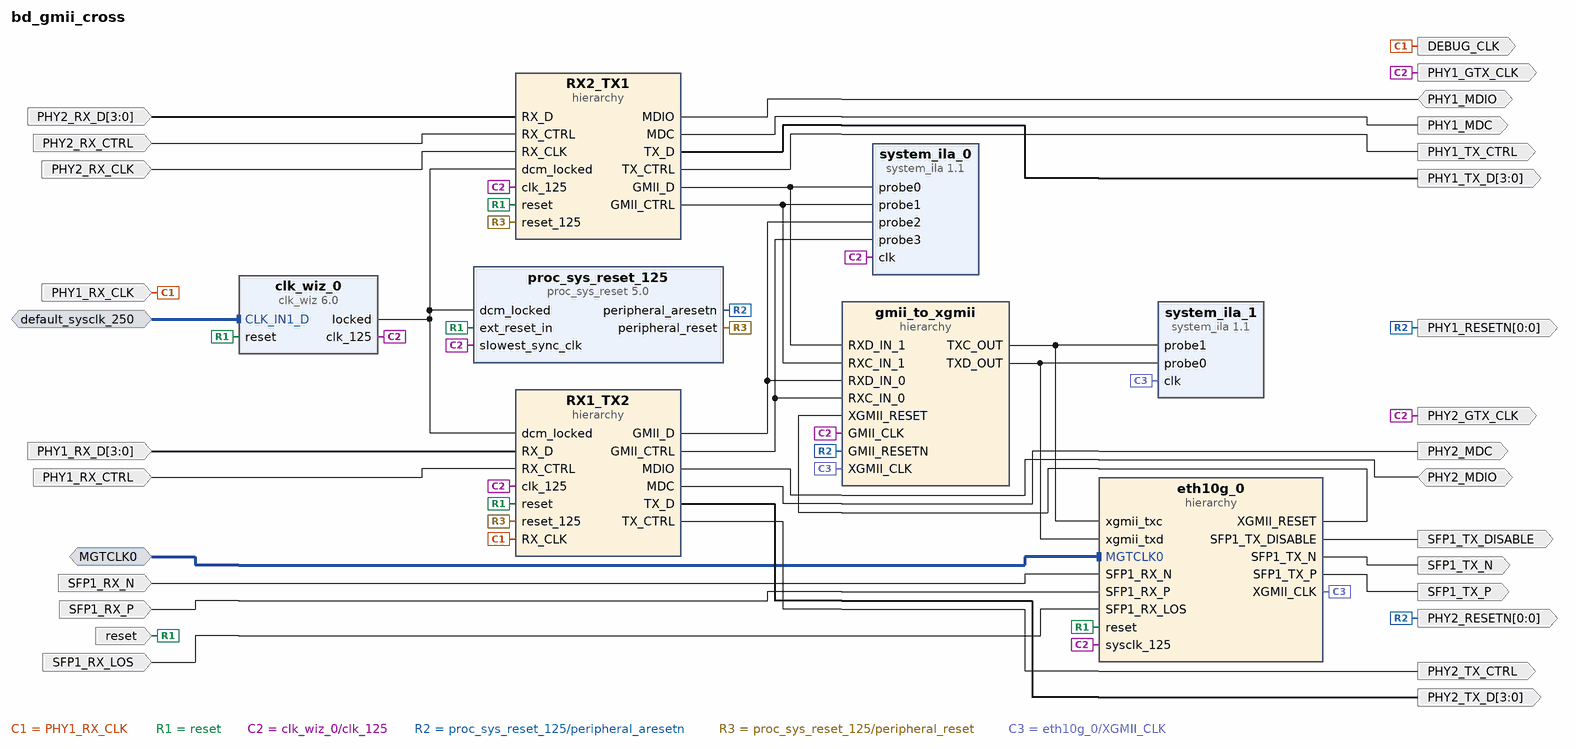
[diagram p0: block diagram of the top level]
# Vivado block design bd_gmii_cross, xcku040-fbva676-1-c, Vivado 2018.2
create_bd_design bd_gmii_cross

create_bd_intf_port -mode Slave -vlnv xilinx.com:interface:diff_clock_rtl:1.0 default_sysclk_250
set_property -dict {CONFIG.FREQ_HZ 250000000} [get_bd_intf_ports default_sysclk_250]
create_bd_intf_port -mode Slave -vlnv xilinx.com:interface:diff_clock_rtl:1.0 MGTCLK0
set_property -dict {CONFIG.FREQ_HZ 156250000} [get_bd_intf_ports MGTCLK0]
create_bd_port -dir I -type clk PHY1_RX_CLK
set_property -dict {CONFIG.FREQ_HZ 125000000} [get_bd_ports PHY1_RX_CLK]
create_bd_port -dir O -type clk DEBUG_CLK
create_bd_port -dir I -type rst reset
set_property -dict {CONFIG.POLARITY ACTIVE_HIGH} [get_bd_ports reset]
create_bd_port -dir IO PHY1_MDIO
create_bd_port -dir O -from 3 -to 0 PHY1_TX_D
create_bd_port -dir O PHY1_MDC
create_bd_port -dir O PHY1_TX_CTRL
create_bd_port -dir O -type clk PHY2_GTX_CLK
create_bd_port -dir O -type clk PHY1_GTX_CLK
create_bd_port -dir I -from 3 -to 0 PHY2_RX_D
create_bd_port -dir I PHY2_RX_CTRL
create_bd_port -dir I -type clk PHY2_RX_CLK
set_property -dict {CONFIG.FREQ_HZ 125000000} [get_bd_ports PHY2_RX_CLK]
create_bd_port -dir I -from 3 -to 0 PHY1_RX_D
create_bd_port -dir I PHY1_RX_CTRL
create_bd_port -dir IO PHY2_MDIO
create_bd_port -dir O -type clk PHY2_MDC
create_bd_port -dir O -from 3 -to 0 PHY2_TX_D
create_bd_port -dir O PHY2_TX_CTRL
create_bd_port -dir I SFP1_RX_N
create_bd_port -dir I SFP1_RX_P
create_bd_port -dir O SFP1_TX_N
create_bd_port -dir O SFP1_TX_P
create_bd_port -dir O SFP1_TX_DISABLE
create_bd_port -dir I SFP1_RX_LOS
create_bd_port -dir O -from 0 -to 0 -type rst PHY1_RESETN
create_bd_port -dir O -from 0 -to 0 PHY2_RESETN

create_bd_cell -type hier RX2_TX1
create_bd_cell -type ip -vlnv xilinx.com:ip:clk_wiz:6.0 clk_wiz_0
set_property -dict [list \
  CONFIG.USE_PHASE_ALIGNMENT true \
  CONFIG.CLKIN1_JITTER_PS 40.0 \
  CONFIG.CLKOUT1_USED true \
  CONFIG.CLKOUT2_USED false \
  CONFIG.CLKOUT3_USED false \
  CONFIG.NUM_OUT_CLKS 1 \
  CONFIG.CLK_OUT1_PORT clk_125 \
  CONFIG.CLK_OUT2_PORT clk_out2 \
  CONFIG.CLK_OUT3_PORT clk_out3 \
  CONFIG.CLKOUT1_REQUESTED_OUT_FREQ 125.000 \
  CONFIG.CLKOUT2_REQUESTED_OUT_FREQ 100.000 \
  CONFIG.CLKOUT3_REQUESTED_OUT_FREQ 100.000 \
  CONFIG.PRIM_SOURCE Differential_clock_capable_pin \
  CONFIG.MMCM_DIVCLK_DIVIDE 1 \
  CONFIG.MMCM_CLKFBOUT_MULT_F 4.000 \
  CONFIG.MMCM_CLKIN1_PERIOD 4.000 \
  CONFIG.MMCM_CLKIN2_PERIOD 10.0 \
  CONFIG.MMCM_CLKOUT0_DIVIDE_F 8.000 \
  CONFIG.MMCM_CLKOUT1_DIVIDE 1 \
  CONFIG.MMCM_CLKOUT2_DIVIDE 1 \
  CONFIG.USE_BOARD_FLOW true \
  CONFIG.CLK_IN1_BOARD_INTERFACE default_sysclk_250 \
  CONFIG.RESET_BOARD_INTERFACE reset \
  CONFIG.CLKOUT1_JITTER 102.531 \
  CONFIG.CLKOUT1_PHASE_ERROR 85.928 \
  CONFIG.CLKOUT2_JITTER 107.111 \
  CONFIG.CLKOUT2_PHASE_ERROR 85.928 \
  CONFIG.CLKOUT3_JITTER 89.528 \
  CONFIG.CLKOUT3_PHASE_ERROR 85.928 \
] [get_bd_cells clk_wiz_0]
create_bd_cell -type hier RX1_TX2
create_bd_cell -type ip -vlnv xilinx.com:ip:system_ila:1.1 system_ila_0
set_property -dict {CONFIG.C_NUM_OF_PROBES 4 CONFIG.C_MON_TYPE NATIVE} [get_bd_cells system_ila_0]
create_bd_cell -type hier eth10g_0
create_bd_cell -type ip -vlnv xilinx.com:ip:proc_sys_reset:5.0 proc_sys_reset_125
create_bd_cell -type hier gmii_to_xgmii
create_bd_cell -type ip -vlnv xilinx.com:ip:system_ila:1.1 system_ila_1
set_property -dict {CONFIG.C_NUM_OF_PROBES 2 CONFIG.C_MON_TYPE NATIVE} [get_bd_cells system_ila_1]

# ---- hierarchy /RX2_TX1 ----
current_bd_instance /RX2_TX1
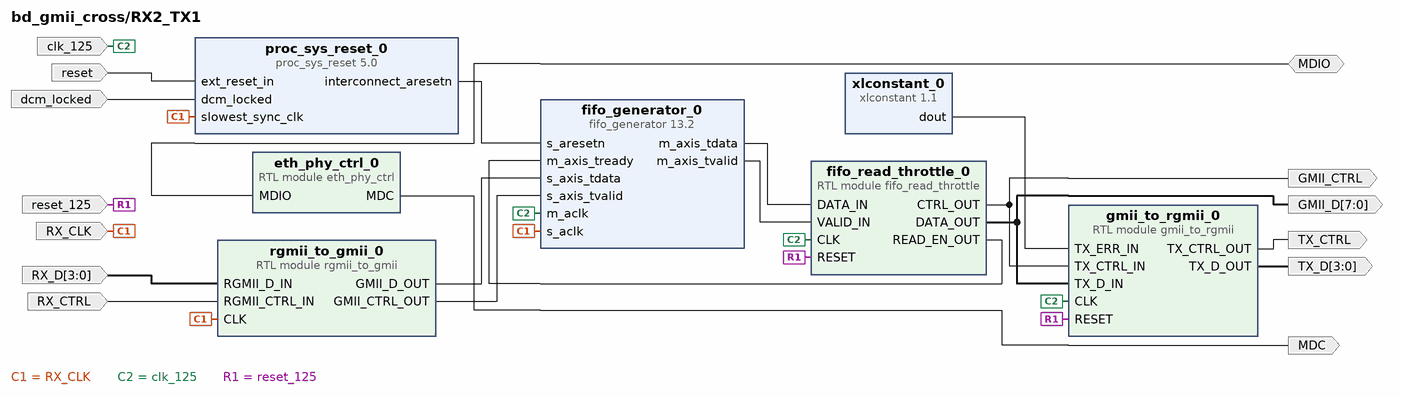
[diagram p1: block diagram inside /RX2_TX1]
create_bd_pin -dir IO MDIO
create_bd_pin -dir I -from 3 -to 0 RX_D
create_bd_pin -dir I RX_CTRL
create_bd_pin -dir O MDC
create_bd_pin -dir I -type clk RX_CLK
create_bd_pin -dir O -from 3 -to 0 TX_D
create_bd_pin -dir O TX_CTRL
create_bd_pin -dir I -type rst reset
create_bd_pin -dir I -type clk clk_125
create_bd_pin -dir I dcm_locked
create_bd_pin -dir O -from 7 -to 0 GMII_D
create_bd_pin -dir O GMII_CTRL
create_bd_pin -dir I -type rst reset_125

create_bd_cell -type module -reference fifo_read_throttle fifo_read_throttle_0
create_bd_cell -type ip -vlnv xilinx.com:ip:fifo_generator:13.2 fifo_generator_0
set_property -dict [list \
  CONFIG.Fifo_Implementation Independent_Clocks_Distributed_RAM \
  CONFIG.INTERFACE_TYPE AXI_STREAM \
  CONFIG.Performance_Options Standard_FIFO \
  CONFIG.Input_Data_Width 8 \
  CONFIG.Input_Depth 32 \
  CONFIG.Full_Flags_Reset_Value 1 \
  CONFIG.Valid_Flag true \
  CONFIG.Clock_Type_AXI Independent_Clock \
  CONFIG.TUSER_WIDTH 0 \
  CONFIG.FIFO_Implementation_wach Independent_Clocks_Distributed_RAM \
  CONFIG.FIFO_Implementation_wdch Independent_Clocks_Builtin_FIFO \
  CONFIG.FIFO_Implementation_wrch Independent_Clocks_Distributed_RAM \
  CONFIG.FIFO_Implementation_rach Independent_Clocks_Distributed_RAM \
  CONFIG.FIFO_Implementation_rdch Independent_Clocks_Builtin_FIFO \
  CONFIG.FIFO_Implementation_axis Independent_Clocks_Distributed_RAM \
  CONFIG.Input_Depth_axis 32 \
] [get_bd_cells fifo_generator_0]
create_bd_cell -type ip -vlnv xilinx.com:ip:xlconstant:1.1 xlconstant_0
set_property -dict {CONFIG.CONST_VAL 0} [get_bd_cells xlconstant_0]
create_bd_cell -type module -reference rgmii_to_gmii rgmii_to_gmii_0
create_bd_cell -type module -reference gmii_to_rgmii gmii_to_rgmii_0
create_bd_cell -type module -reference eth_phy_ctrl eth_phy_ctrl_0
create_bd_cell -type ip -vlnv xilinx.com:ip:proc_sys_reset:5.0 proc_sys_reset_0

# ---- hierarchy /RX1_TX2 ----
current_bd_instance /RX1_TX2
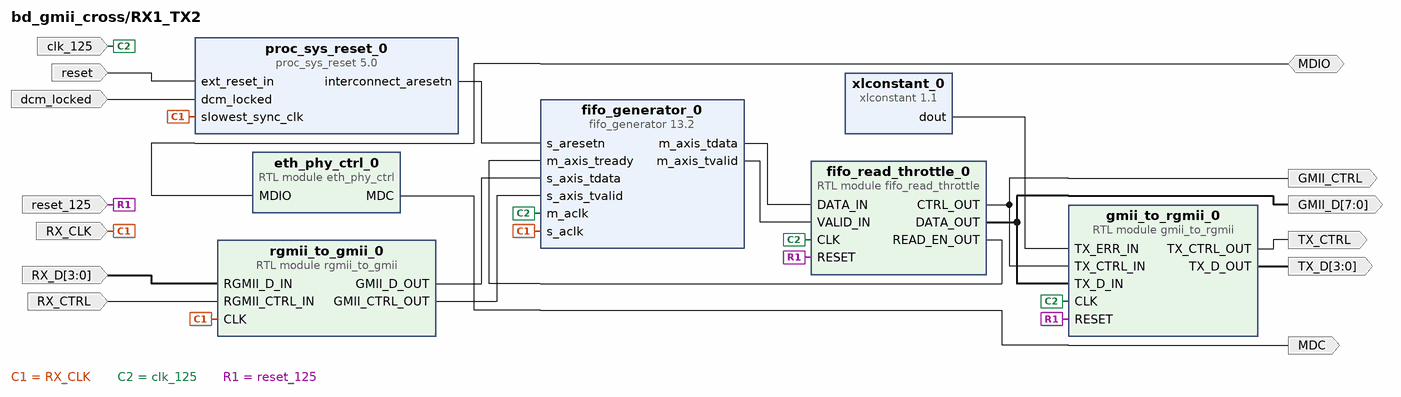
[diagram p2: block diagram inside /RX1_TX2]
create_bd_pin -dir IO MDIO
create_bd_pin -dir I -from 3 -to 0 RX_D
create_bd_pin -dir I RX_CTRL
create_bd_pin -dir O MDC
create_bd_pin -dir I -type clk RX_CLK
create_bd_pin -dir O -from 3 -to 0 TX_D
create_bd_pin -dir O TX_CTRL
create_bd_pin -dir I -type rst reset
create_bd_pin -dir I -type clk clk_125
create_bd_pin -dir I dcm_locked
create_bd_pin -dir O -from 7 -to 0 GMII_D
create_bd_pin -dir O GMII_CTRL
create_bd_pin -dir I -type rst reset_125

create_bd_cell -type module -reference fifo_read_throttle fifo_read_throttle_0
create_bd_cell -type ip -vlnv xilinx.com:ip:fifo_generator:13.2 fifo_generator_0
set_property -dict [list \
  CONFIG.Fifo_Implementation Independent_Clocks_Distributed_RAM \
  CONFIG.INTERFACE_TYPE AXI_STREAM \
  CONFIG.Performance_Options Standard_FIFO \
  CONFIG.Input_Data_Width 8 \
  CONFIG.Input_Depth 32 \
  CONFIG.Full_Flags_Reset_Value 1 \
  CONFIG.Valid_Flag true \
  CONFIG.Clock_Type_AXI Independent_Clock \
  CONFIG.TUSER_WIDTH 0 \
  CONFIG.FIFO_Implementation_wach Independent_Clocks_Distributed_RAM \
  CONFIG.FIFO_Implementation_wdch Independent_Clocks_Builtin_FIFO \
  CONFIG.FIFO_Implementation_wrch Independent_Clocks_Distributed_RAM \
  CONFIG.FIFO_Implementation_rach Independent_Clocks_Distributed_RAM \
  CONFIG.FIFO_Implementation_rdch Independent_Clocks_Builtin_FIFO \
  CONFIG.FIFO_Implementation_axis Independent_Clocks_Distributed_RAM \
  CONFIG.Input_Depth_axis 32 \
] [get_bd_cells fifo_generator_0]
create_bd_cell -type ip -vlnv xilinx.com:ip:proc_sys_reset:5.0 proc_sys_reset_0
create_bd_cell -type ip -vlnv xilinx.com:ip:xlconstant:1.1 xlconstant_0
set_property -dict {CONFIG.CONST_VAL 0} [get_bd_cells xlconstant_0]
create_bd_cell -type module -reference rgmii_to_gmii rgmii_to_gmii_0
create_bd_cell -type module -reference gmii_to_rgmii gmii_to_rgmii_0
create_bd_cell -type module -reference eth_phy_ctrl eth_phy_ctrl_0

# ---- hierarchy /eth10g_0 ----
current_bd_instance /eth10g_0
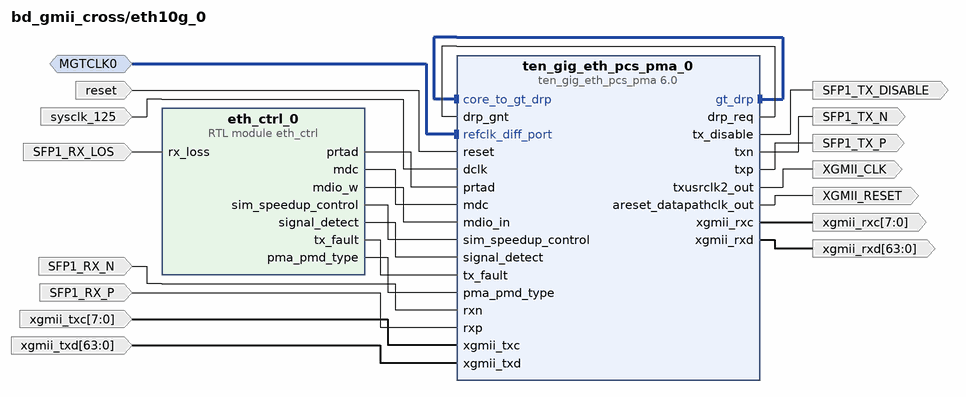
[diagram p3: block diagram inside /eth10g_0]
create_bd_intf_pin -mode Slave -vlnv xilinx.com:interface:diff_clock_rtl:1.0 MGTCLK0
create_bd_pin -dir I -type rst reset
create_bd_pin -dir I -type clk sysclk_125
create_bd_pin -dir I SFP1_RX_N
create_bd_pin -dir I SFP1_RX_P
create_bd_pin -dir O SFP1_TX_N
create_bd_pin -dir O SFP1_TX_P
create_bd_pin -dir O SFP1_TX_DISABLE
create_bd_pin -dir I SFP1_RX_LOS
create_bd_pin -dir O -type clk XGMII_CLK
create_bd_pin -dir O -type rst XGMII_RESET
create_bd_pin -dir O -from 7 -to 0 xgmii_rxc
create_bd_pin -dir O -from 63 -to 0 xgmii_rxd
create_bd_pin -dir I -from 7 -to 0 xgmii_txc
create_bd_pin -dir I -from 63 -to 0 xgmii_txd

create_bd_cell -type ip -vlnv xilinx.com:ip:ten_gig_eth_pcs_pma:6.0 ten_gig_eth_pcs_pma_0
set_property -dict [list \
  CONFIG.base_kr BASE-R \
  CONFIG.no_ebuff false \
  CONFIG.SupportLevel 1 \
  CONFIG.Locations X0Y8 \
  CONFIG.RefClk clk0 \
] [get_bd_cells ten_gig_eth_pcs_pma_0]
create_bd_cell -type module -reference eth_ctrl eth_ctrl_0

# ---- hierarchy /gmii_to_xgmii ----
current_bd_instance /gmii_to_xgmii
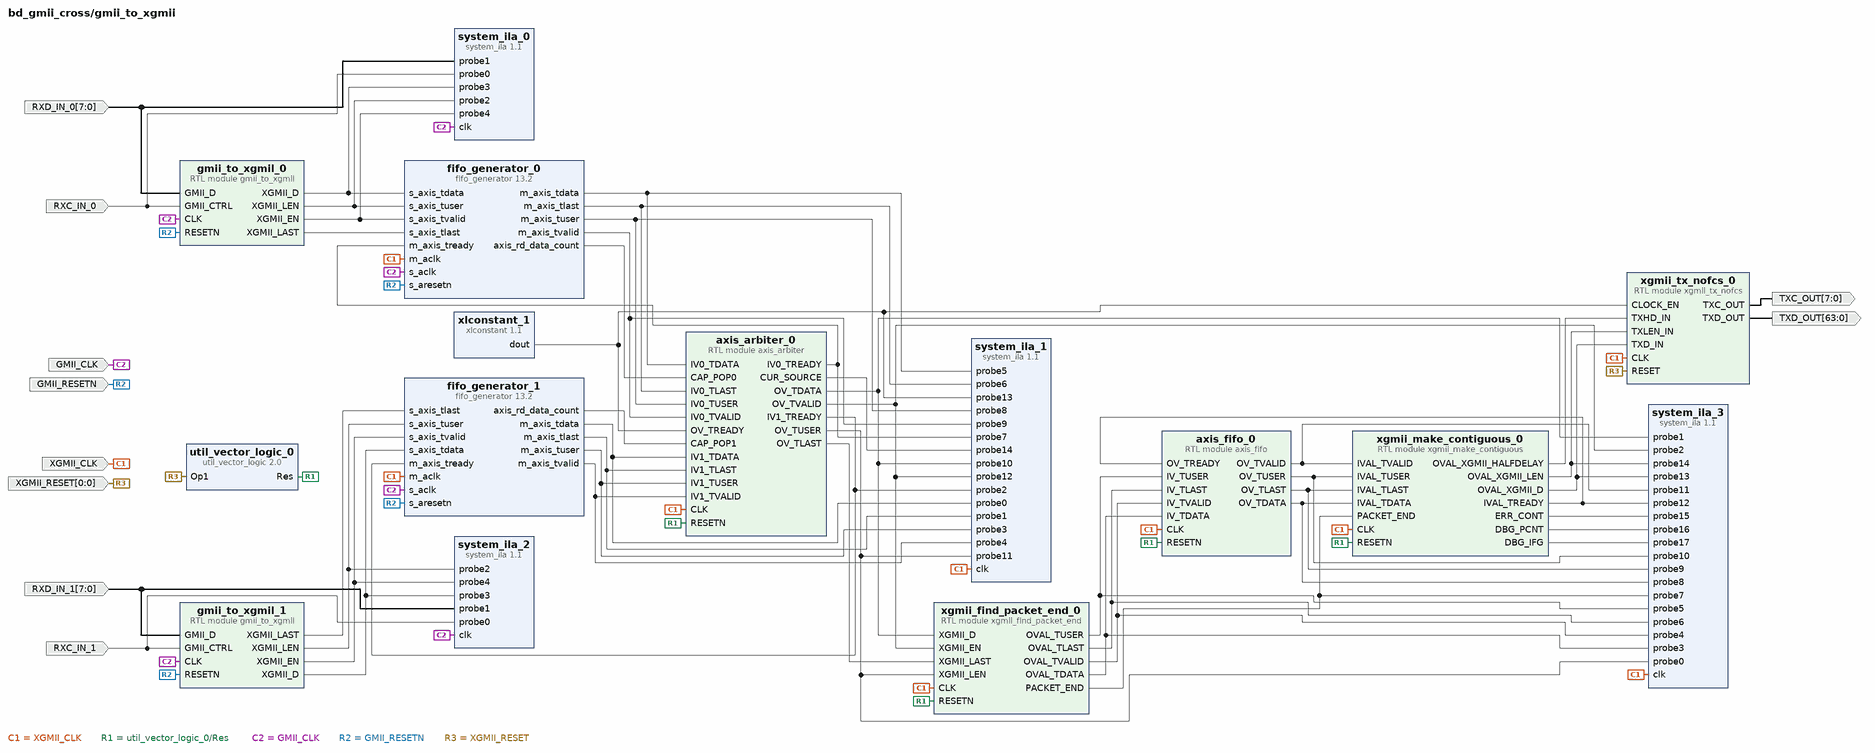
[diagram p4: block diagram inside /gmii_to_xgmii]
create_bd_pin -dir I -type clk XGMII_CLK
create_bd_pin -dir I -type clk GMII_CLK
create_bd_pin -dir I -from 7 -to 0 RXD_IN_0
create_bd_pin -dir I RXC_IN_0
create_bd_pin -dir I -type rst GMII_RESETN
create_bd_pin -dir I -from 0 -to 0 XGMII_RESET
create_bd_pin -dir O -from 63 -to 0 TXD_OUT
create_bd_pin -dir O -from 7 -to 0 TXC_OUT
create_bd_pin -dir I -from 7 -to 0 RXD_IN_1
create_bd_pin -dir I RXC_IN_1

create_bd_cell -type module -reference axis_fifo axis_fifo_0
set_property -dict {CONFIG.WIDTH_USER 4 CONFIG.FIFO_SIZE_L2 11} [get_bd_cells axis_fifo_0]
create_bd_cell -type ip -vlnv xilinx.com:ip:fifo_generator:13.2 fifo_generator_0
set_property -dict [list \
  CONFIG.INTERFACE_TYPE AXI_STREAM \
  CONFIG.Clock_Type_AXI Independent_Clock \
  CONFIG.TDATA_NUM_BYTES 8 \
  CONFIG.TUSER_WIDTH 4 \
  CONFIG.Enable_TLAST true \
  CONFIG.FIFO_Implementation_wach Independent_Clocks_Distributed_RAM \
  CONFIG.FIFO_Implementation_wdch Independent_Clocks_Builtin_FIFO \
  CONFIG.FIFO_Implementation_wrch Independent_Clocks_Distributed_RAM \
  CONFIG.FIFO_Implementation_rach Independent_Clocks_Distributed_RAM \
  CONFIG.FIFO_Implementation_rdch Independent_Clocks_Builtin_FIFO \
  CONFIG.FIFO_Implementation_axis Independent_Clocks_Block_RAM \
  CONFIG.Input_Depth_axis 2048 \
  CONFIG.Enable_Data_Counts_axis true \
] [get_bd_cells fifo_generator_0]
create_bd_cell -type ip -vlnv xilinx.com:ip:xlconstant:1.1 xlconstant_1
create_bd_cell -type ip -vlnv xilinx.com:ip:util_vector_logic:2.0 util_vector_logic_0
set_property -dict {CONFIG.C_SIZE 1 CONFIG.C_OPERATION not} [get_bd_cells util_vector_logic_0]
create_bd_cell -type ip -vlnv xilinx.com:ip:system_ila:1.1 system_ila_0
set_property -dict {CONFIG.C_NUM_OF_PROBES 5 CONFIG.C_MON_TYPE NATIVE} [get_bd_cells system_ila_0]
create_bd_cell -type ip -vlnv xilinx.com:ip:fifo_generator:13.2 fifo_generator_1
set_property -dict [list \
  CONFIG.INTERFACE_TYPE AXI_STREAM \
  CONFIG.Clock_Type_AXI Independent_Clock \
  CONFIG.TDATA_NUM_BYTES 8 \
  CONFIG.TUSER_WIDTH 4 \
  CONFIG.Enable_TLAST true \
  CONFIG.FIFO_Implementation_wach Independent_Clocks_Distributed_RAM \
  CONFIG.FIFO_Implementation_wdch Independent_Clocks_Builtin_FIFO \
  CONFIG.FIFO_Implementation_wrch Independent_Clocks_Distributed_RAM \
  CONFIG.FIFO_Implementation_rach Independent_Clocks_Distributed_RAM \
  CONFIG.FIFO_Implementation_rdch Independent_Clocks_Builtin_FIFO \
  CONFIG.FIFO_Implementation_axis Independent_Clocks_Block_RAM \
  CONFIG.Input_Depth_axis 2048 \
  CONFIG.Enable_Data_Counts_axis true \
] [get_bd_cells fifo_generator_1]
create_bd_cell -type module -reference axis_arbiter axis_arbiter_0
create_bd_cell -type ip -vlnv xilinx.com:ip:system_ila:1.1 system_ila_1
set_property -dict {CONFIG.C_NUM_OF_PROBES 15 CONFIG.C_NUM_MONITOR_SLOTS 15 CONFIG.C_MON_TYPE NATIVE} [get_bd_cells system_ila_1]
create_bd_cell -type ip -vlnv xilinx.com:ip:system_ila:1.1 system_ila_2
set_property -dict {CONFIG.C_NUM_OF_PROBES 5 CONFIG.C_NUM_MONITOR_SLOTS 5 CONFIG.C_MON_TYPE NATIVE} [get_bd_cells system_ila_2]
create_bd_cell -type module -reference gmii_to_xgmil gmii_to_xgmil_0
create_bd_cell -type module -reference gmii_to_xgmil gmii_to_xgmil_1
create_bd_cell -type ip -vlnv xilinx.com:ip:system_ila:1.1 system_ila_3
set_property -dict {CONFIG.C_NUM_OF_PROBES 18 CONFIG.C_MON_TYPE NATIVE} [get_bd_cells system_ila_3]
create_bd_cell -type module -reference xgmii_find_packet_end xgmii_find_packet_end_0
create_bd_cell -type module -reference xgmii_make_contiguous xgmii_make_contiguous_0
create_bd_cell -type module -reference xgmii_tx_nofcs xgmii_tx_nofcs_0

# ---- connections ----

current_bd_instance /RX2_TX1
connect_bd_net [get_bd_pins MDIO] [get_bd_pins eth_phy_ctrl_0/MDIO]
connect_bd_net -net PHY1_RX_D_1 [get_bd_pins RX_D] [get_bd_pins rgmii_to_gmii_0/RGMII_D_IN]
connect_bd_net -net PHY1_RX_CTRL_1 [get_bd_pins RX_CTRL] [get_bd_pins rgmii_to_gmii_0/RGMII_CTRL_IN]
connect_bd_net [get_bd_pins eth_phy_ctrl_0/MDC] [get_bd_pins MDC]
connect_bd_net -net PHY1_RX_CLK_1 [get_bd_pins RX_CLK] \
  [get_bd_pins fifo_generator_0/s_aclk] [get_bd_pins rgmii_to_gmii_0/CLK] [get_bd_pins proc_sys_reset_0/slowest_sync_clk]
connect_bd_net [get_bd_pins clk_125] [get_bd_pins fifo_read_throttle_0/CLK] [get_bd_pins fifo_generator_0/m_aclk] [get_bd_pins gmii_to_rgmii_0/CLK]
connect_bd_net [get_bd_pins gmii_to_rgmii_0/TX_D_OUT] [get_bd_pins TX_D]
connect_bd_net [get_bd_pins gmii_to_rgmii_0/TX_CTRL_OUT] [get_bd_pins TX_CTRL]
connect_bd_net -net proc_sys_reset_1_peripheral_reset [get_bd_pins reset_125] \
  [get_bd_pins fifo_read_throttle_0/RESET] [get_bd_pins gmii_to_rgmii_0/RESET]
connect_bd_net [get_bd_pins reset] [get_bd_pins proc_sys_reset_0/ext_reset_in]
connect_bd_net -net clk_wiz_0_locked [get_bd_pins dcm_locked] [get_bd_pins proc_sys_reset_0/dcm_locked]
connect_bd_net [get_bd_pins fifo_generator_0/m_axis_tdata] [get_bd_pins fifo_read_throttle_0/DATA_IN]
connect_bd_net [get_bd_pins fifo_generator_0/m_axis_tvalid] [get_bd_pins fifo_read_throttle_0/VALID_IN]
connect_bd_net [get_bd_pins fifo_read_throttle_0/READ_EN_OUT] [get_bd_pins fifo_generator_0/m_axis_tready]
connect_bd_net [get_bd_pins rgmii_to_gmii_0/GMII_D_OUT] [get_bd_pins fifo_generator_0/s_axis_tdata]
connect_bd_net [get_bd_pins rgmii_to_gmii_0/GMII_CTRL_OUT] [get_bd_pins fifo_generator_0/s_axis_tvalid]
connect_bd_net [get_bd_pins fifo_read_throttle_0/CTRL_OUT] [get_bd_pins GMII_CTRL] [get_bd_pins gmii_to_rgmii_0/TX_CTRL_IN]
connect_bd_net [get_bd_pins xlconstant_0/dout] [get_bd_pins gmii_to_rgmii_0/TX_ERR_IN]
connect_bd_net [get_bd_pins fifo_read_throttle_0/DATA_OUT] [get_bd_pins GMII_D] [get_bd_pins gmii_to_rgmii_0/TX_D_IN]
connect_bd_net [get_bd_pins proc_sys_reset_0/interconnect_aresetn] [get_bd_pins fifo_generator_0/s_aresetn]

current_bd_instance /RX1_TX2
connect_bd_net [get_bd_pins MDIO] [get_bd_pins eth_phy_ctrl_0/MDIO]
connect_bd_net -net PHY1_RX_D_1 [get_bd_pins RX_D] [get_bd_pins rgmii_to_gmii_0/RGMII_D_IN]
connect_bd_net -net PHY1_RX_CTRL_1 [get_bd_pins RX_CTRL] [get_bd_pins rgmii_to_gmii_0/RGMII_CTRL_IN]
connect_bd_net [get_bd_pins eth_phy_ctrl_0/MDC] [get_bd_pins MDC]
connect_bd_net -net PHY1_RX_CLK_1 [get_bd_pins RX_CLK] \
  [get_bd_pins fifo_generator_0/s_aclk] [get_bd_pins proc_sys_reset_0/slowest_sync_clk] [get_bd_pins rgmii_to_gmii_0/CLK]
connect_bd_net [get_bd_pins clk_125] [get_bd_pins fifo_read_throttle_0/CLK] [get_bd_pins fifo_generator_0/m_aclk] [get_bd_pins gmii_to_rgmii_0/CLK]
connect_bd_net [get_bd_pins gmii_to_rgmii_0/TX_D_OUT] [get_bd_pins TX_D]
connect_bd_net [get_bd_pins gmii_to_rgmii_0/TX_CTRL_OUT] [get_bd_pins TX_CTRL]
connect_bd_net -net proc_sys_reset_1_peripheral_reset [get_bd_pins reset_125] \
  [get_bd_pins fifo_read_throttle_0/RESET] [get_bd_pins gmii_to_rgmii_0/RESET]
connect_bd_net [get_bd_pins reset] [get_bd_pins proc_sys_reset_0/ext_reset_in]
connect_bd_net -net clk_wiz_0_locked [get_bd_pins dcm_locked] [get_bd_pins proc_sys_reset_0/dcm_locked]
connect_bd_net [get_bd_pins fifo_generator_0/m_axis_tdata] [get_bd_pins fifo_read_throttle_0/DATA_IN]
connect_bd_net [get_bd_pins fifo_generator_0/m_axis_tvalid] [get_bd_pins fifo_read_throttle_0/VALID_IN]
connect_bd_net [get_bd_pins fifo_read_throttle_0/READ_EN_OUT] [get_bd_pins fifo_generator_0/m_axis_tready]
connect_bd_net [get_bd_pins proc_sys_reset_0/interconnect_aresetn] [get_bd_pins fifo_generator_0/s_aresetn]
connect_bd_net [get_bd_pins rgmii_to_gmii_0/GMII_D_OUT] [get_bd_pins fifo_generator_0/s_axis_tdata]
connect_bd_net [get_bd_pins rgmii_to_gmii_0/GMII_CTRL_OUT] [get_bd_pins fifo_generator_0/s_axis_tvalid]
connect_bd_net [get_bd_pins fifo_read_throttle_0/CTRL_OUT] [get_bd_pins GMII_CTRL] [get_bd_pins gmii_to_rgmii_0/TX_CTRL_IN]
connect_bd_net [get_bd_pins xlconstant_0/dout] [get_bd_pins gmii_to_rgmii_0/TX_ERR_IN]
connect_bd_net [get_bd_pins fifo_read_throttle_0/DATA_OUT] [get_bd_pins GMII_D] [get_bd_pins gmii_to_rgmii_0/TX_D_IN]

current_bd_instance /eth10g_0
connect_bd_intf_net [get_bd_intf_pins ten_gig_eth_pcs_pma_0/core_to_gt_drp] [get_bd_intf_pins ten_gig_eth_pcs_pma_0/gt_drp]
connect_bd_intf_net [get_bd_intf_pins MGTCLK0] [get_bd_intf_pins ten_gig_eth_pcs_pma_0/refclk_diff_port]
connect_bd_net [get_bd_pins ten_gig_eth_pcs_pma_0/drp_req] [get_bd_pins ten_gig_eth_pcs_pma_0/drp_gnt]
connect_bd_net -net reset1_1 [get_bd_pins reset] [get_bd_pins ten_gig_eth_pcs_pma_0/reset]
connect_bd_net -net sysclk_125_1 [get_bd_pins sysclk_125] [get_bd_pins ten_gig_eth_pcs_pma_0/dclk]
connect_bd_net [get_bd_pins SFP1_RX_N] [get_bd_pins ten_gig_eth_pcs_pma_0/rxn]
connect_bd_net [get_bd_pins SFP1_RX_P] [get_bd_pins ten_gig_eth_pcs_pma_0/rxp]
connect_bd_net [get_bd_pins ten_gig_eth_pcs_pma_0/txn] [get_bd_pins SFP1_TX_N]
connect_bd_net [get_bd_pins ten_gig_eth_pcs_pma_0/txp] [get_bd_pins SFP1_TX_P]
connect_bd_net [get_bd_pins ten_gig_eth_pcs_pma_0/tx_disable] [get_bd_pins SFP1_TX_DISABLE]
connect_bd_net [get_bd_pins eth_ctrl_0/prtad] [get_bd_pins ten_gig_eth_pcs_pma_0/prtad]
connect_bd_net [get_bd_pins eth_ctrl_0/mdc] [get_bd_pins ten_gig_eth_pcs_pma_0/mdc]
connect_bd_net [get_bd_pins eth_ctrl_0/mdio_w] [get_bd_pins ten_gig_eth_pcs_pma_0/mdio_in]
connect_bd_net [get_bd_pins eth_ctrl_0/sim_speedup_control] [get_bd_pins ten_gig_eth_pcs_pma_0/sim_speedup_control]
connect_bd_net [get_bd_pins SFP1_RX_LOS] [get_bd_pins eth_ctrl_0/rx_loss]
connect_bd_net [get_bd_pins eth_ctrl_0/signal_detect] [get_bd_pins ten_gig_eth_pcs_pma_0/signal_detect]
connect_bd_net [get_bd_pins eth_ctrl_0/tx_fault] [get_bd_pins ten_gig_eth_pcs_pma_0/tx_fault]
connect_bd_net [get_bd_pins eth_ctrl_0/pma_pmd_type] [get_bd_pins ten_gig_eth_pcs_pma_0/pma_pmd_type]
connect_bd_net [get_bd_pins ten_gig_eth_pcs_pma_0/txusrclk2_out] [get_bd_pins XGMII_CLK]
connect_bd_net [get_bd_pins ten_gig_eth_pcs_pma_0/areset_datapathclk_out] [get_bd_pins XGMII_RESET]
connect_bd_net [get_bd_pins ten_gig_eth_pcs_pma_0/xgmii_rxc] [get_bd_pins xgmii_rxc]
connect_bd_net [get_bd_pins ten_gig_eth_pcs_pma_0/xgmii_rxd] [get_bd_pins xgmii_rxd]
connect_bd_net -net xgmii_txc_0_1 [get_bd_pins xgmii_txc] [get_bd_pins ten_gig_eth_pcs_pma_0/xgmii_txc]
connect_bd_net -net xgmii_txd_0_1 [get_bd_pins xgmii_txd] [get_bd_pins ten_gig_eth_pcs_pma_0/xgmii_txd]

current_bd_instance /gmii_to_xgmii
connect_bd_net -net CLK_1 [get_bd_pins XGMII_CLK] \
  [get_bd_pins axis_fifo_0/CLK] [get_bd_pins fifo_generator_0/m_aclk] [get_bd_pins fifo_generator_1/m_aclk] \
  [get_bd_pins axis_arbiter_0/CLK] [get_bd_pins system_ila_1/clk] [get_bd_pins system_ila_3/clk] \
  [get_bd_pins xgmii_find_packet_end_0/CLK] [get_bd_pins xgmii_make_contiguous_0/CLK] [get_bd_pins xgmii_tx_nofcs_0/CLK]
connect_bd_net -net RESETN_1 [get_bd_pins util_vector_logic_0/Res] \
  [get_bd_pins axis_fifo_0/RESETN] [get_bd_pins axis_arbiter_0/RESETN] [get_bd_pins xgmii_find_packet_end_0/RESETN] \
  [get_bd_pins xgmii_make_contiguous_0/RESETN]
connect_bd_net [get_bd_pins xgmii_make_contiguous_0/IVAL_TREADY] [get_bd_pins axis_fifo_0/OV_TREADY] [get_bd_pins system_ila_3/probe12]
connect_bd_net [get_bd_pins axis_fifo_0/OV_TVALID] [get_bd_pins system_ila_3/probe11] [get_bd_pins xgmii_make_contiguous_0/IVAL_TVALID]
connect_bd_net [get_bd_pins axis_fifo_0/OV_TUSER] [get_bd_pins system_ila_3/probe10] [get_bd_pins xgmii_make_contiguous_0/IVAL_TUSER]
connect_bd_net [get_bd_pins axis_fifo_0/OV_TLAST] [get_bd_pins system_ila_3/probe9] [get_bd_pins xgmii_make_contiguous_0/IVAL_TLAST]
connect_bd_net [get_bd_pins axis_fifo_0/OV_TDATA] [get_bd_pins system_ila_3/probe8] [get_bd_pins xgmii_make_contiguous_0/IVAL_TDATA]
connect_bd_net [get_bd_pins xgmii_find_packet_end_0/OVAL_TUSER] [get_bd_pins axis_fifo_0/IV_TUSER] [get_bd_pins system_ila_3/probe5]
connect_bd_net [get_bd_pins xgmii_find_packet_end_0/OVAL_TLAST] [get_bd_pins axis_fifo_0/IV_TLAST] [get_bd_pins system_ila_3/probe6]
connect_bd_net [get_bd_pins xgmii_find_packet_end_0/OVAL_TVALID] [get_bd_pins axis_fifo_0/IV_TVALID] [get_bd_pins system_ila_3/probe4]
connect_bd_net [get_bd_pins xgmii_find_packet_end_0/OVAL_TDATA] [get_bd_pins axis_fifo_0/IV_TDATA] [get_bd_pins system_ila_3/probe3]
connect_bd_net [get_bd_pins xgmii_find_packet_end_0/PACKET_END] [get_bd_pins system_ila_3/probe7] [get_bd_pins xgmii_make_contiguous_0/PACKET_END]
connect_bd_net -net s_aclk_1 [get_bd_pins GMII_CLK] \
  [get_bd_pins fifo_generator_0/s_aclk] [get_bd_pins system_ila_0/clk] [get_bd_pins fifo_generator_1/s_aclk] \
  [get_bd_pins system_ila_2/clk] [get_bd_pins gmii_to_xgmil_0/CLK] [get_bd_pins gmii_to_xgmil_1/CLK]
connect_bd_net -net gmii_to_xgmii_axis_arbiter_0_OV_TDATA [get_bd_pins axis_arbiter_0/OV_TDATA] \
  [get_bd_pins system_ila_1/probe10] [get_bd_pins system_ila_3/probe1] [get_bd_pins xgmii_find_packet_end_0/XGMII_D]
connect_bd_net -net gmii_to_xgmii_axis_arbiter_0_OV_TVALID [get_bd_pins axis_arbiter_0/OV_TVALID] \
  [get_bd_pins system_ila_1/probe12] [get_bd_pins system_ila_3/probe2] [get_bd_pins xgmii_find_packet_end_0/XGMII_EN]
connect_bd_net -net gmii_to_xgmii_axis_arbiter_0_OV_TUSER [get_bd_pins axis_arbiter_0/OV_TUSER] \
  [get_bd_pins system_ila_1/probe11] [get_bd_pins system_ila_3/probe0] [get_bd_pins xgmii_find_packet_end_0/XGMII_LEN]
connect_bd_net -net gmii_to_xgmil_0_RXD_OUT [get_bd_pins gmii_to_xgmil_0/XGMII_D] \
  [get_bd_pins fifo_generator_0/s_axis_tdata] [get_bd_pins system_ila_0/probe3]
connect_bd_net [get_bd_pins RXD_IN_0] [get_bd_pins system_ila_0/probe1] [get_bd_pins gmii_to_xgmil_0/GMII_D]
connect_bd_net [get_bd_pins RXC_IN_0] [get_bd_pins system_ila_0/probe0] [get_bd_pins gmii_to_xgmil_0/GMII_CTRL]
connect_bd_net -net RESETN1_1 [get_bd_pins GMII_RESETN] \
  [get_bd_pins fifo_generator_0/s_aresetn] [get_bd_pins fifo_generator_1/s_aresetn] [get_bd_pins gmii_to_xgmil_0/RESETN] \
  [get_bd_pins gmii_to_xgmil_1/RESETN]
connect_bd_net -net gmii_to_xgmil_0_RXLEN_OUT [get_bd_pins gmii_to_xgmil_0/XGMII_LEN] \
  [get_bd_pins fifo_generator_0/s_axis_tuser] [get_bd_pins system_ila_0/probe2]
connect_bd_net -net gmii_to_xgmil_0_CE_OUT [get_bd_pins gmii_to_xgmil_0/XGMII_EN] \
  [get_bd_pins fifo_generator_0/s_axis_tvalid] [get_bd_pins system_ila_0/probe4]
connect_bd_net -net gmii_to_xgmii_xlconstant_1_dout [get_bd_pins xlconstant_1/dout] \
  [get_bd_pins axis_arbiter_0/OV_TREADY] [get_bd_pins system_ila_1/probe13] [get_bd_pins xgmii_tx_nofcs_0/CLOCK_EN]
connect_bd_net -net Op1_1 [get_bd_pins XGMII_RESET] [get_bd_pins util_vector_logic_0/Op1] [get_bd_pins xgmii_tx_nofcs_0/RESET]
connect_bd_net [get_bd_pins xgmii_make_contiguous_0/OVAL_XGMII_LEN] [get_bd_pins system_ila_3/probe14] [get_bd_pins xgmii_tx_nofcs_0/TXLEN_IN]
connect_bd_net [get_bd_pins xgmii_make_contiguous_0/OVAL_XGMII_D] [get_bd_pins system_ila_3/probe13] [get_bd_pins xgmii_tx_nofcs_0/TXD_IN]
connect_bd_net [get_bd_pins xgmii_tx_nofcs_0/TXD_OUT] [get_bd_pins TXD_OUT]
connect_bd_net [get_bd_pins xgmii_tx_nofcs_0/TXC_OUT] [get_bd_pins TXC_OUT]
connect_bd_net [get_bd_pins fifo_generator_0/m_axis_tdata] [get_bd_pins axis_arbiter_0/IV0_TDATA] [get_bd_pins system_ila_1/probe5]
connect_bd_net [get_bd_pins fifo_generator_0/m_axis_tlast] [get_bd_pins axis_arbiter_0/IV0_TLAST] [get_bd_pins system_ila_1/probe6]
connect_bd_net [get_bd_pins fifo_generator_0/m_axis_tuser] [get_bd_pins axis_arbiter_0/IV0_TUSER] [get_bd_pins system_ila_1/probe8]
connect_bd_net [get_bd_pins fifo_generator_0/m_axis_tvalid] [get_bd_pins axis_arbiter_0/IV0_TVALID] [get_bd_pins system_ila_1/probe9]
connect_bd_net [get_bd_pins fifo_generator_0/axis_rd_data_count] [get_bd_pins axis_arbiter_0/CAP_POP0]
connect_bd_net [get_bd_pins gmii_to_xgmil_0/XGMII_LAST] [get_bd_pins fifo_generator_0/s_axis_tlast]
connect_bd_net -net GMII_D_0_1 [get_bd_pins RXD_IN_1] [get_bd_pins system_ila_2/probe1] [get_bd_pins gmii_to_xgmil_1/GMII_D]
connect_bd_net -net GMII_CTRL_0_1 [get_bd_pins RXC_IN_1] [get_bd_pins system_ila_2/probe0] [get_bd_pins gmii_to_xgmil_1/GMII_CTRL]
connect_bd_net [get_bd_pins gmii_to_xgmil_1/XGMII_LEN] [get_bd_pins fifo_generator_1/s_axis_tuser] [get_bd_pins system_ila_2/probe2]
connect_bd_net [get_bd_pins gmii_to_xgmil_1/XGMII_EN] [get_bd_pins fifo_generator_1/s_axis_tvalid] [get_bd_pins system_ila_2/probe4]
connect_bd_net [get_bd_pins gmii_to_xgmil_1/XGMII_LAST] [get_bd_pins fifo_generator_1/s_axis_tlast]
connect_bd_net [get_bd_pins fifo_generator_1/m_axis_tdata] [get_bd_pins axis_arbiter_0/IV1_TDATA] [get_bd_pins system_ila_1/probe0]
connect_bd_net [get_bd_pins fifo_generator_1/m_axis_tlast] [get_bd_pins axis_arbiter_0/IV1_TLAST] [get_bd_pins system_ila_1/probe1]
connect_bd_net [get_bd_pins fifo_generator_1/m_axis_tuser] [get_bd_pins axis_arbiter_0/IV1_TUSER] [get_bd_pins system_ila_1/probe3]
connect_bd_net [get_bd_pins fifo_generator_1/m_axis_tvalid] [get_bd_pins axis_arbiter_0/IV1_TVALID] [get_bd_pins system_ila_1/probe4]
connect_bd_net [get_bd_pins fifo_generator_1/axis_rd_data_count] [get_bd_pins axis_arbiter_0/CAP_POP1]
connect_bd_net [get_bd_pins gmii_to_xgmil_1/XGMII_D] [get_bd_pins fifo_generator_1/s_axis_tdata] [get_bd_pins system_ila_2/probe3]
connect_bd_net [get_bd_pins axis_arbiter_0/IV0_TREADY] [get_bd_pins fifo_generator_0/m_axis_tready] [get_bd_pins system_ila_1/probe7]
connect_bd_net [get_bd_pins axis_arbiter_0/IV1_TREADY] [get_bd_pins fifo_generator_1/m_axis_tready] [get_bd_pins system_ila_1/probe2]
connect_bd_net [get_bd_pins axis_arbiter_0/CUR_SOURCE] [get_bd_pins system_ila_1/probe14]
connect_bd_net [get_bd_pins xgmii_make_contiguous_0/ERR_CONT] [get_bd_pins system_ila_3/probe15]
connect_bd_net [get_bd_pins xgmii_make_contiguous_0/DBG_PCNT] [get_bd_pins system_ila_3/probe16]
connect_bd_net [get_bd_pins xgmii_make_contiguous_0/DBG_IFG] [get_bd_pins system_ila_3/probe17]
connect_bd_net [get_bd_pins axis_arbiter_0/OV_TLAST] [get_bd_pins xgmii_find_packet_end_0/XGMII_LAST]
connect_bd_net [get_bd_pins xgmii_make_contiguous_0/OVAL_XGMII_HALFDELAY] [get_bd_pins xgmii_tx_nofcs_0/TXHD_IN]

current_bd_instance /
connect_bd_intf_net -intf_net default_sysclk_250_1 [get_bd_intf_ports default_sysclk_250] [get_bd_intf_pins clk_wiz_0/CLK_IN1_D]
connect_bd_intf_net -intf_net MGTCLK0_1 [get_bd_intf_ports MGTCLK0] [get_bd_intf_pins eth10g_0/MGTCLK0]
connect_bd_net [get_bd_ports PHY1_RX_CLK] [get_bd_ports DEBUG_CLK] [get_bd_pins RX1_TX2/RX_CLK]
connect_bd_net [get_bd_ports reset] \
  [get_bd_pins clk_wiz_0/reset] [get_bd_pins proc_sys_reset_125/ext_reset_in] [get_bd_pins RX2_TX1/reset] \
  [get_bd_pins RX1_TX2/reset] [get_bd_pins eth10g_0/reset]
connect_bd_net [get_bd_ports PHY1_MDIO] [get_bd_pins RX2_TX1/MDIO]
connect_bd_net [get_bd_pins RX2_TX1/TX_D] [get_bd_ports PHY1_TX_D]
connect_bd_net [get_bd_pins RX2_TX1/MDC] [get_bd_ports PHY1_MDC]
connect_bd_net [get_bd_pins RX2_TX1/TX_CTRL] [get_bd_ports PHY1_TX_CTRL]
connect_bd_net [get_bd_pins clk_wiz_0/clk_125] \
  [get_bd_ports PHY1_GTX_CLK] [get_bd_ports PHY2_GTX_CLK] [get_bd_pins system_ila_0/clk] \
  [get_bd_pins proc_sys_reset_125/slowest_sync_clk] [get_bd_pins RX2_TX1/clk_125] [get_bd_pins RX1_TX2/clk_125] \
  [get_bd_pins gmii_to_xgmii/GMII_CLK] [get_bd_pins eth10g_0/sysclk_125]
connect_bd_net [get_bd_pins clk_wiz_0/locked] \
  [get_bd_pins proc_sys_reset_125/dcm_locked] [get_bd_pins RX2_TX1/dcm_locked] [get_bd_pins RX1_TX2/dcm_locked]
connect_bd_net -net RX_D_0_1 [get_bd_ports PHY2_RX_D] [get_bd_pins RX2_TX1/RX_D]
connect_bd_net -net RX_CTRL_0_1 [get_bd_ports PHY2_RX_CTRL] [get_bd_pins RX2_TX1/RX_CTRL]
connect_bd_net -net RX_CLK_0_1 [get_bd_ports PHY2_RX_CLK] [get_bd_pins RX2_TX1/RX_CLK]
connect_bd_net [get_bd_ports PHY1_RX_D] [get_bd_pins RX1_TX2/RX_D]
connect_bd_net [get_bd_ports PHY1_RX_CTRL] [get_bd_pins RX1_TX2/RX_CTRL]
connect_bd_net [get_bd_ports PHY2_MDIO] [get_bd_pins RX1_TX2/MDIO]
connect_bd_net [get_bd_pins RX1_TX2/MDC] [get_bd_ports PHY2_MDC]
connect_bd_net [get_bd_pins RX1_TX2/TX_D] [get_bd_ports PHY2_TX_D]
connect_bd_net [get_bd_pins RX1_TX2/TX_CTRL] [get_bd_ports PHY2_TX_CTRL]
connect_bd_net [get_bd_pins RX2_TX1/GMII_D] [get_bd_pins system_ila_0/probe0] [get_bd_pins gmii_to_xgmii/RXD_IN_1]
connect_bd_net [get_bd_pins RX2_TX1/GMII_CTRL] [get_bd_pins system_ila_0/probe1] [get_bd_pins gmii_to_xgmii/RXC_IN_1]
connect_bd_net [get_bd_pins RX1_TX2/GMII_D] [get_bd_pins system_ila_0/probe2] [get_bd_pins gmii_to_xgmii/RXD_IN_0]
connect_bd_net [get_bd_pins RX1_TX2/GMII_CTRL] [get_bd_pins system_ila_0/probe3] [get_bd_pins gmii_to_xgmii/RXC_IN_0]
connect_bd_net [get_bd_ports SFP1_RX_N] [get_bd_pins eth10g_0/SFP1_RX_N]
connect_bd_net [get_bd_ports SFP1_RX_P] [get_bd_pins eth10g_0/SFP1_RX_P]
connect_bd_net [get_bd_pins eth10g_0/SFP1_TX_N] [get_bd_ports SFP1_TX_N]
connect_bd_net [get_bd_pins eth10g_0/SFP1_TX_P] [get_bd_ports SFP1_TX_P]
connect_bd_net [get_bd_pins eth10g_0/SFP1_TX_DISABLE] [get_bd_ports SFP1_TX_DISABLE]
connect_bd_net [get_bd_ports SFP1_RX_LOS] [get_bd_pins eth10g_0/SFP1_RX_LOS]
connect_bd_net -net proc_sys_reset_1_peripheral_aresetn [get_bd_pins proc_sys_reset_125/peripheral_aresetn] \
  [get_bd_ports PHY2_RESETN] [get_bd_ports PHY1_RESETN] [get_bd_pins gmii_to_xgmii/GMII_RESETN]
connect_bd_net -net proc_sys_reset_1_peripheral_reset [get_bd_pins proc_sys_reset_125/peripheral_reset] \
  [get_bd_pins RX1_TX2/reset_125] [get_bd_pins RX2_TX1/reset_125]
connect_bd_net [get_bd_pins eth10g_0/XGMII_CLK] [get_bd_pins system_ila_1/clk] [get_bd_pins gmii_to_xgmii/XGMII_CLK]
connect_bd_net [get_bd_pins eth10g_0/XGMII_RESET] [get_bd_pins gmii_to_xgmii/XGMII_RESET]
connect_bd_net -net xgmii_txc_1 [get_bd_pins gmii_to_xgmii/TXC_OUT] [get_bd_pins system_ila_1/probe1] [get_bd_pins eth10g_0/xgmii_txc]
connect_bd_net -net xgmii_txd_1 [get_bd_pins gmii_to_xgmii/TXD_OUT] [get_bd_pins system_ila_1/probe0] [get_bd_pins eth10g_0/xgmii_txd]

validate_bd_design
save_bd_design
